# EAGLE design fio_8x8 (EAGLE 5.00)
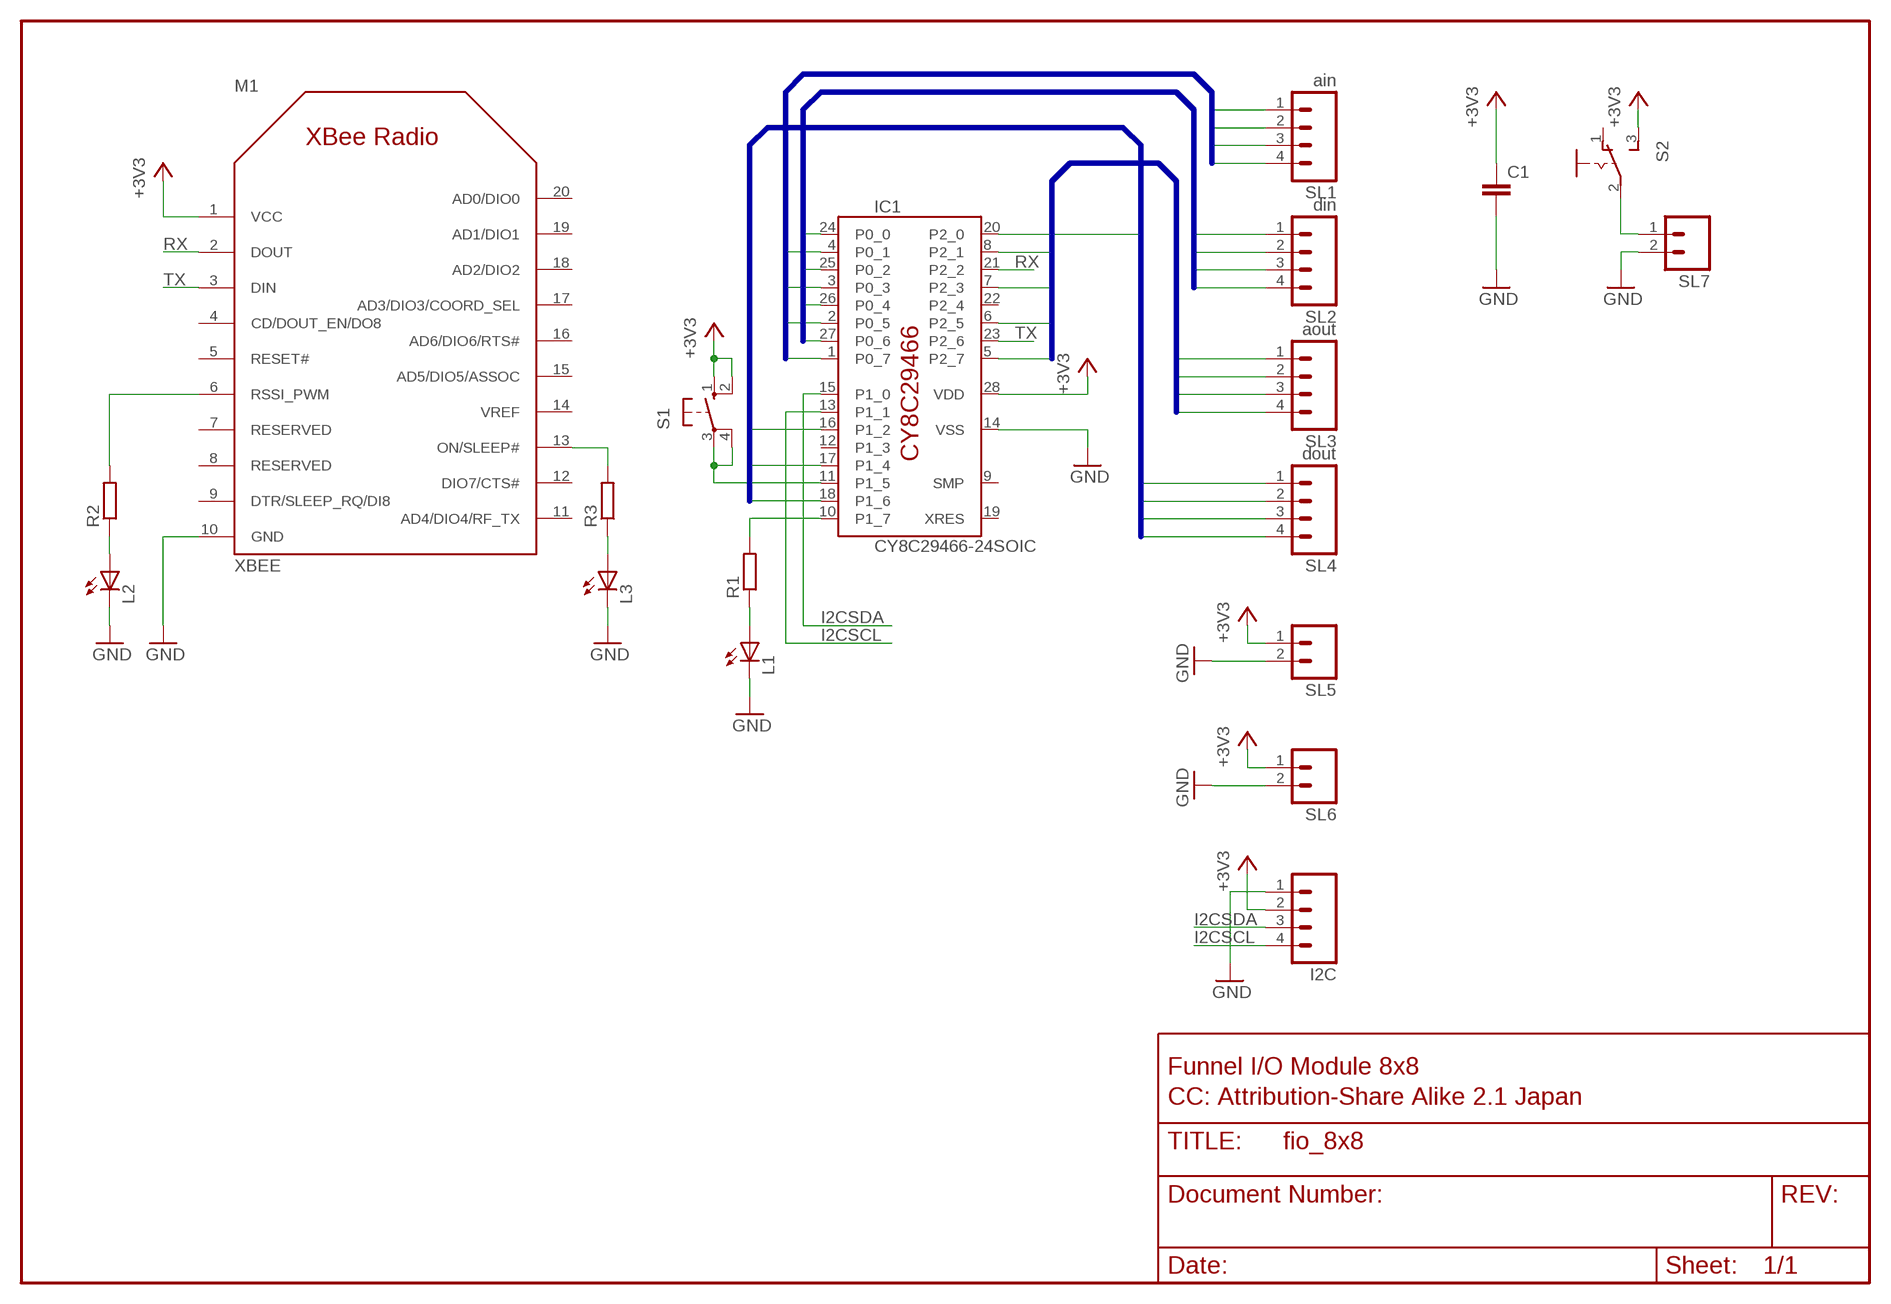
[diagram p0: schematic, sheet 1]

## Parts
C1  C-EUC0603K  [C0603K]
I2C  M04PTH  [1X04]
IC1  CY8C29466-24SOIC  [SOIC28]
L1  LEDCHIPLED_0805  [CHIPLED_0805]
L2  LEDCHIPLED_0805  [CHIPLED_0805]
L3  LEDCHIPLED_0805  [CHIPLED_0805]
M1  XBEE  [XBEE]
R1  R-EU_R0603  [R0603]
R2  R-EU_R0603  [R0603]
R3  R-EU_R0603  [R0603]
S1  10-XX  [B3F-10XX]
S2  S-SWITCH-3  [DS-3]
SL1  ain  M04PTH  [1X04]
SL2  din  M04PTH  [1X04]
SL3  aout  M04PTH  [1X04]
SL4  dout  M04PTH  [1X04]
SL5  M02PTH  [1X02]
SL6  M02PTH  [1X02]
SL7  M02POLAR  [MOLEX-1X2]

## Nets
+3V3: C1.1 I2C.2 IC1.28(VDD) M1.1(VCC) S1.1(S) S1.2(S1) S2.3(S) SL5.1 SL6.1
AIN1: IC1.1(P0_7) SL1.1
AIN2: IC1.2(P0_5) SL1.2
AIN3: IC1.3(P0_3) SL1.3
AIN4: IC1.4(P0_1) SL1.4
AOUT1: IC1.5(P2_7) SL3.1
AOUT2: IC1.6(P2_5) SL3.2
AOUT3: IC1.7(P2_3) SL3.3
AOUT4: IC1.8(P2_1) SL3.4
DIN1: IC1.27(P0_6) SL2.1
DIN2: IC1.26(P0_4) SL2.2
DIN3: IC1.25(P0_2) SL2.3
DIN4: IC1.24(P0_0) SL2.4
DOUT1: IC1.20(P2_0) SL4.1
DOUT2: IC1.18(P1_6) SL4.2
DOUT3: IC1.17(P1_4) SL4.3
DOUT4: IC1.16(P1_2) SL4.4
GND: C1.2 I2C.1 IC1.14(VSS) L1.C L2.C L3.C M1.10(GND) SL5.2 SL6.2 SL7.2
I2CSCL: I2C.4 IC1.13(P1_1)
I2CSDA: I2C.3 IC1.15(P1_0)
N$1: S2.2(P) SL7.1
N$3: L2.A R2.1
N$4: M1.6(RSSI_PWM) R2.2
N$5: M1.13(ON/SLEEP#) R3.2
N$6: L3.A R3.1
N$8: IC1.11(P1_5) S1.3(P) S1.4(P1)
N$9: IC1.10(P1_7) R1.2
N$10: L1.A R1.1
RX: IC1.21(P2_2) M1.2(DOUT)
TX: IC1.23(P2_6) M1.3(DIN)
Unconnected: IC1.9(SMP) IC1.12(P1_3) IC1.19(XRES) IC1.22(P2_4) M1.4(CD/DOUT_EN/DO8) M1.5(RESET#) M1.7(RESERVED) M1.8(RESERVED) M1.9(DTR/SLEEP_RQ/DI8) M1.11(AD4/DIO4/RF_TX) M1.12(DIO7/CTS#) M1.14(VREF) M1.15(AD5/DIO5/ASSOC) M1.16(AD6/DIO6/RTS#) M1.17(AD3/DIO3/COORD_SEL) M1.18(AD2/DIO2) M1.19(AD1/DIO1) M1.20(AD0/DIO0) S2.1(O)

## Buses
AIN[1..4]
DIN[1..4]
AOUT[1..4]
DOUT[1..4]

## Notes on the sheet
- Funnel I/O Module 8x8
- CC: Attribution-Share Alike 2.1 Japan

## Library data of the parts
C1 = rcl:C-EU: CAPACITOR, European symbol
I2C SL1-SL4 = SparkFun-3-2-07:M04: Header 4 Standard 4-pin 0.1" header. Use with straight break away headers (SKU : PType-HD), right angle break away headers (PType-HD-RightAngle), swiss pins (PType-30F), machine pins (PType-MP), and female headers (PType-FH). Molex polarized connector foot print use with SKU : Con-Hdr with associated crimp pins and housings.
IC1 = cypress-psoc:CY8C29466-24*
L1-L3 = led:LED: LED OSRAM: - CHIPLED LG R971, LG N971, LY N971, LG Q971, LY Q971, LO R971, LY R971 LH N974, LH R974 LS Q976, LO Q976, LY Q976 LO Q996 - Hyper CHIPLED LW Q18S LB Q993, LB Q99A, LB R99A - SideLED LS A670, LO A670, LY A670, LG A670, LP A670 LB A673, LV A673, LT A673, LW A673 LH A674 LY A675 LS A676, LA A676, LO A676, LY A676, LW A676 LS A679, LY A679, LG A679 - Hyper Micro SIDELED® LS Y876, LA Y876, LO Y876, LY Y876 LT Y87S - SmartLED LW L88C, LW L88S LB L89C, LB L89S, LG L890 LS L89K, LO L89K, LY L89K LS L896, LA L896, LO L896, LY L896 - TOPLED LS T670, LO T670, LY T670, LG T670, LP T670 LSG T670, LSP T670, LSY T670, LOP T670, LYG T670 LG T671, LOG T671, LSG T671 LB T673, LV T673, LT T673, LW T673 LH T674 LS T676, LA T676, LO T676, LY T676, LB T676, LH T676, LSB T676, LW T676 LB T67C, LV T67C, LT T67C, LS T67K, LO T67K, LY T67K, LW E67C LS E67B, LA E67B, LO E67B, LY E67B, LB E67C, LV E67C, LT E67C LW T67C LS T679, LY T679, LG T679 LS T770, LO T770, LY T770, LG T770, LP T770 LB T773, LV T773, LT T773, LW T773 LH T774 LS E675, LA E675, LY E675, LS T675 LS T776, LA T776, LO T776, LY T776, LB T776 LHGB T686 LT T68C, LB T68C - Hyper Mini TOPLED® LB M676 - Mini TOPLED Santana® LG M470 LS M47K, LO M47K, LY M47K Source: http://www.osram.convergy.de - LUMILED® LXK2-PW12-R00, LXK2-PW12-S00, LXK2-PW14-U00, LXK2-PW14-V00 LXK2-PM12-R00, LXK2-PM12-S00, LXK2-PM14-U00 LXK2-PE12-Q00, LXK2-PE12-R00, LXK2-PE12-S00, LXK2-PE14-T00, LXK2-PE14-U00 LXK2-PB12-K00, LXK2-PB12-L00, LXK2-PB12-M00, LXK2-PB14-N00, LXK2-PB14-P00, LXK2-PB14-Q00 LXK2-PR12-L00, LXK2-PR12-M00, LXK2-PR14-Q00, LXK2-PR14-R00 LXK2-PD12-Q00, LXK2-PD12-R00, LXK2-PD12-S00 LXK2-PH12-R00, LXK2-PH12-S00 LXK2-PL12-P00, LXK2-PL12-Q00, LXK2-PL12-R00 Source: www.luxeon.com
M1 = xbee_r1:XBEE
R1-R3 = rcl:R-EU_: RESISTOR, European symbol
S1 = switch-omron:10-XX: OMRON SWITCH
S2 = 1-sw:S-SWITCH: SLIDE SWITCH
SL5-SL7 = SparkFun-3-2-07:M02: Header 2 Standard 2-pin 0.1" header. Use with straight break away headers (SKU : PType-HD), right angle break away headers (PType-HD-RightAngle), swiss pins (PType-30F), machine pins (PType-MP), and female headers (PType-FH). Molex polarized connector foot print use with SKU : Con-Hdr with associated crimp pins and housings.

## Net classes
1 +5v: width 0.813 mm
2 GND: width 0.813 mm

## Board
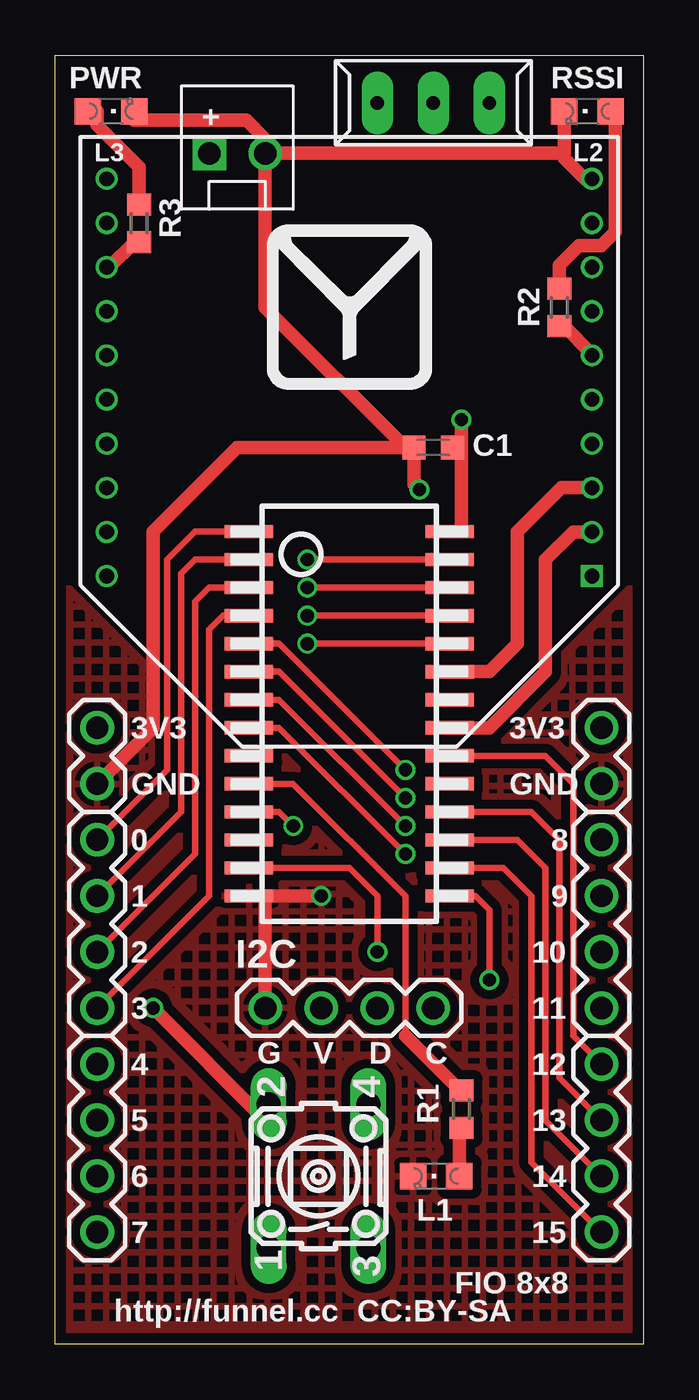
[diagram p1: board, top side]
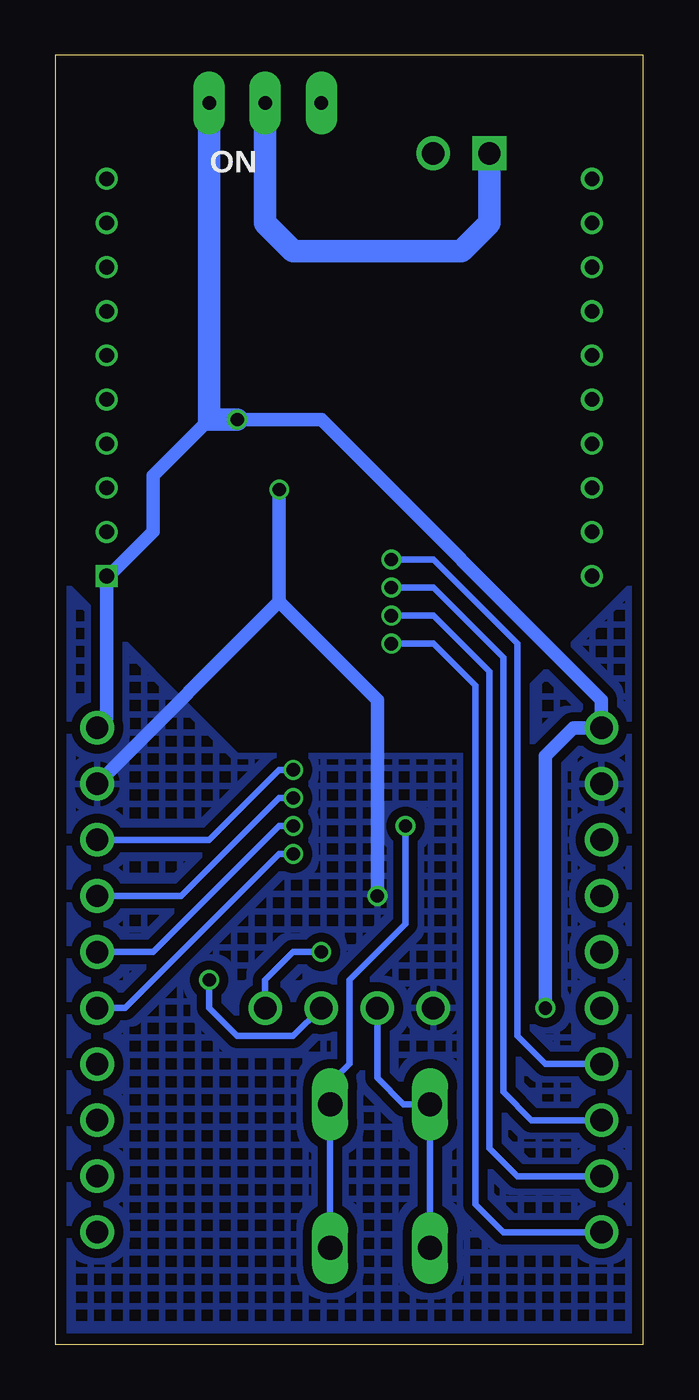
[diagram p2: board, bottom side, seen from below]

Size 26.67 x 58.42 mm. Coordinates in mm from the lower left corner, seen from the top.
Outline: 26.67,58.42 26.67,0 0,0 0,58.42 26.67,58.42
Copper layers (1*16): Top 0.035mm / dielectric 1.5mm / Bottom 0.035mm
Design rules "p_ban_2layer": minimum track width 5mil, minimum drill 0.3mm, track to track 5mil, track to pad 5mil, pad to pad 5mil, via to via 5mil, smd to smd 5mil, copper to edge 0.5mm, drill to drill 0.3mm, minimum pad ring 0.15mm, minimum via ring 0.15mm, stop-mask expansion 4mil, vias tented up to drill 0.35mm, thermal gap 10mil

### Footprints (pad centres in the part's own frame; a part is rotated, then mirrored left to right if it is on the bottom)
C0603K = smd 1.05 x 1.08: 1 -0.875,0; 2 0.875,0
1X04 = drill 1.016 round: 1 0,0; 2 2.54,0; 3 5.08,0; 4 7.62,0
SOIC28 = smd 0.6 x 2.2: 1 8.89,4.548; 2 7.62,4.548; 3 6.35,4.548; 4 5.08,4.548; 5 3.81,4.548; 6 2.54,4.548; 7 1.27,4.548; 8 0,4.548; 9 -1.27,4.548; 10 -2.54,4.548; 11 -3.81,4.548; 12 -5.08,4.548; 13 -6.35,4.548; 14 -7.62,4.548; 15 -7.62,-4.548; 16 -6.35,-4.548; 17 -5.08,-4.548; 18 -3.81,-4.548; 19 -2.54,-4.548; 20 -1.27,-4.548; 21 0,-4.548; 22 1.27,-4.548; 23 2.54,-4.548; 24 3.81,-4.548; 25 5.08,-4.548; 26 6.35,-4.548; 27 7.62,-4.548; 28 8.89,-4.548
CHIPLED_0805 = smd 1.2 x 1.2: A 0,-1.05; C 0,1.05
XBEE = drill 0.66 square: 1 -11,9 | drill 0.66 round: 2 -11,7; 3 -11,5; 4 -11,3; 5 -11,1; 6 -11,-1; 7 -11,-3; 8 -11,-5; 9 -11,-7; 10 -11,-9; 11 11,-9; 12 11,-7; 13 11,-5; 14 11,-3; 15 11,-1; 16 11,1; 17 11,3; 18 11,5; 19 11,7; 20 11,9
R0603 = smd 1 x 1.1: 1 -0.85,0; 2 0.85,0
B3F-10XX = drill 1.092 long: 1 -3.251,2.261; 2 3.251,2.261; 3 -3.251,-2.261; 4 3.251,-2.261
DS-3 = drill 0.61 pad 1.422 long: 1 0,-2.54; 2 0,0; 3 0,2.54
1X02 = drill 1.016 round: 1 0,0; 2 2.54,0
MOLEX-1X2 = drill 1.016 square: 1 0,0 | drill 1.016 round: 2 2.54,0

### Placement (x,y rotation side)
C1  17.14,40.64 180 top
I2C  9.53,15.24 0 top
IC1  13.33,27.94 90 top
L1  17.27,7.62 90 top
L2  24.13,55.88 90 top
L3  2.54,55.88 270 top
M1  13.33,43.81 180 top
R1  18.41,10.67 90 top
R2  22.86,46.99 270 top
R3  3.81,50.8 270 top
S1  11.94,7.62 90 top
S2  17.14,56.26 270 top
SL1  1.9,22.86 270 top
SL2  1.9,12.7 270 top
SL3  24.77,22.86 270 top
SL4  24.77,12.7 270 top
SL5  1.9,27.94 270 top
SL6  24.77,27.94 270 top
SL7  6.98,53.98 0 top
U$1  [FUNNEL_LOGO_SILK]  13.33,46.99 0 top

### Tracks (layer width: path | path; a pad name or v marks a point on that pad's centre or on a via)
+3V3  (via drill 0.6)
  Top 0.61: IC1.28 18.41,36.83 18.41,40.64 | v18.41,41.91 18.41,40.64 | 18.41,40.64 C1.1 | v4.44,15.24 9.53,10.16 9.68,10.31 S1.2
  Bottom 0.305: S1.1 9.6,4.37 9.53,4.45 9.68,4.6 S1.2 10.87,10.87 12.06,12.07 I2C.2
  Bottom 0.61: SL6.1 24.34,28.37 M1.1 24.24,34.81 22.23,36.83 22.23,39.37 19.69,41.91 | v18.41,41.91 14.6,41.91 1.9,29.21 SL5.1 3.17,27.94 4.44,26.67 v4.44,15.24
  Bottom 1.016: S2.3 19.69,41.91 v18.41,41.91
AIN1
  Top 0.305: SL1.1 5.08,26.04 5.08,35.56 6.35,36.83 IC1.1
AIN2
  Top 0.305: SL1.2 5.71,24.13 5.71,34.92 6.35,35.56 IC1.2
AIN3
  Top 0.305: SL1.3 6.35,22.22 6.35,33.66 6.98,34.29 IC1.3
AIN4
  Top 0.305: SL1.4 6.98,20.32 6.98,32.38 7.62,33.02 IC1.4
AOUT1  (via drill 0.6)
  Top 0.305: IC1.5 10.16,31.75 v15.87,26.04
  Bottom 0.305: 23.49,22.86 22.86,22.86 | 23.49,22.86 SL3.1 | v15.87,26.04 16.51,26.04 19.69,22.86 23.49,22.86
AOUT2  (via drill 0.6)
  Top 0.305: IC1.6 10.16,30.48 v15.87,24.77
  Bottom 0.305: v15.87,24.77 16.51,24.77 20.95,20.32 SL3.2
AOUT3  (via drill 0.6)
  Top 0.305: IC1.7 10.16,29.21 v15.87,23.49
  Bottom 0.305: 23.49,17.78 22.86,17.78 | 23.49,17.78 SL3.3 | v15.87,23.49 16.51,23.49 22.23,17.78 23.49,17.78
AOUT4  (via drill 0.6)
  Top 0.305: IC1.8 10.16,27.94 v15.87,22.22
  Bottom 0.305: SL3.4 23.49,15.24 16.51,22.22 v15.87,22.22
DIN1  (via drill 0.6)
  Top 0.305: v11.43,35.56 IC1.27
  Bottom 0.305: v11.43,35.56 9.53,35.56 5.71,31.75 5.71,13.97 4.44,12.7 SL2.1
DIN2  (via drill 0.6)
  Top 0.305: v11.43,34.29 IC1.26
  Bottom 0.305: v11.43,34.29 9.53,34.29 6.35,31.11 6.35,11.43 5.08,10.16 SL2.2
DIN3  (via drill 0.6)
  Top 0.305: v11.43,33.02 IC1.25
  Bottom 0.305: v11.43,33.02 9.53,33.02 6.98,30.48 6.98,8.89 5.71,7.62 SL2.3
DIN4  (via drill 0.6)
  Top 0.305: v11.43,31.75 IC1.24
  Bottom 0.305: v11.43,31.75 9.53,31.75 7.62,29.84 7.62,6.35 6.35,5.08 SL2.4
DOUT1
  Top 0.305: SL4.1 23.49,13.97 23.49,25.4 22.23,26.67 IC1.20
DOUT2
  Top 0.305: SL4.2 22.86,12.07 22.86,22.86 21.59,24.13 IC1.18
DOUT3
  Top 0.305: SL4.3 22.23,10.16 22.23,21.59 20.95,22.86 IC1.17
DOUT4
  Top 0.305: SL4.4 21.59,8.25 21.59,20.32 20.32,21.59 IC1.16
GND  (via drill 0.6)
  Top 0.305: 3.59,55.46 L3.C | M1.10 24.34,52.91 | 23.08,53.98 23.08,53.76
  Top 0.61: 15.87,40.64 9.53,46.99 SL7.2 | SL5.2 4.44,27.94 4.44,36.83 8.26,40.64 15.87,40.64 | 15.87,40.64 C1.2 16.27,38.98 v16.51,38.73 | 9.53,20.32 v12.06,20.32 | 9.53,20.32 IC1.14 | I2C.1 9.53,20.32 | L2.C 23.08,53.98 SL7.2 | M1.10 24.02,52.81 23.08,53.76 | 3.59,55.46 8.67,55.46 9.53,54.61 SL7.2
  Bottom 0.61: 16.51,33.66 v16.51,38.73 | 16.51,33.66 SL6.2 | v12.06,20.32 12.06,29.21 16.51,33.66
  pour Top (isolate 0.406, hatched): 0.63,34.29 8.26,26.67 18.41,26.67 26.03,34.29 26.67,34.29 26.67,0 0,0 0,34.29
  pour Bottom (isolate 0.406, hatched): 0,34.29 0.63,34.29 8.26,26.67 18.41,26.67 26.03,34.29 26.67,34.29 26.67,0 0,0
I2CSCL  (via drill 0.6)
  Top 0.305: IC1.13 13.33,21.59 14.6,20.32 v14.6,17.78
  Bottom 0.305: v14.6,17.78 15.87,17.78 17.14,16.51 I2C.4
I2CSDA  (via drill 0.6)
  Top 0.305: IC1.15 19.05,20.32 19.69,19.68 v19.69,16.51
  Bottom 0.305: v19.69,16.51 19.69,15.24 18.41,13.97 15.87,13.97 I2C.3
N$1
  Bottom 1.016: S2.2 17.14,50.8 15.87,49.53 8.26,49.53 6.98,50.8 SL7.1
N$3
  Top 0.305: 25.4,55.88 L2.A
  Top 0.61: R2.1 22.86,48.89 23.75,49.78 24.77,49.78 25.4,50.42 25.4,55.88
N$4
  Top 0.305: M1.6 24.34,44.88 | 23.07,46.14 R2.2
  Top 0.61: 24.34,44.88 23.07,46.14
N$5
  Top 0.305: R3.2 3.59,49.95
  Top 0.61: M1.13 2.46,48.81 3.59,49.95
N$6
  Top 0.61: R3.1 3.81,53.34 1.9,55.24 1.9,55.88 L3.A
N$8  (via drill 0.6)
  Top 0.305: IC1.11 10.16,24.13 v10.79,23.49
  Bottom 0.305: v10.79,23.49 10.79,19.05 13.33,16.51 13.33,12.7 14.2,11.84 S1.4 S1.3 14.2,4.22 14.6,3.81
N$9
  Top 0.305: IC1.10 10.79,25.4 15.87,20.32 15.87,13.97
  Top 0.61: R1.2 18.41,11.43 15.87,13.97
N$10
  Top 0.61: R1.1 18.41,9.53 18.32,9.43 L1.A
RX
  Top 0.61: M1.2 23.48,36.81 22.23,35.56 22.23,30.48 19.69,27.94 IC1.21
TX
  Top 0.61: IC1.23 19.69,30.48 20.95,31.75 20.95,36.83 22.94,38.81 M1.3

### Text on the board
tPlace: PWR | RSSI | + | 3V3 | 3V3 | GND | GND | 0 | 8 | 1 | 9 | 2 | 10 | 3 | 11 | 4 | G | V | D | C | 12 | 5 | 13 | 6 | 14 | 7 | 15 | http://funnel.cc CC:BY-SA
bPlace: ON
tNames: FIO 8x8
tStop: ABC
bStop: ABC